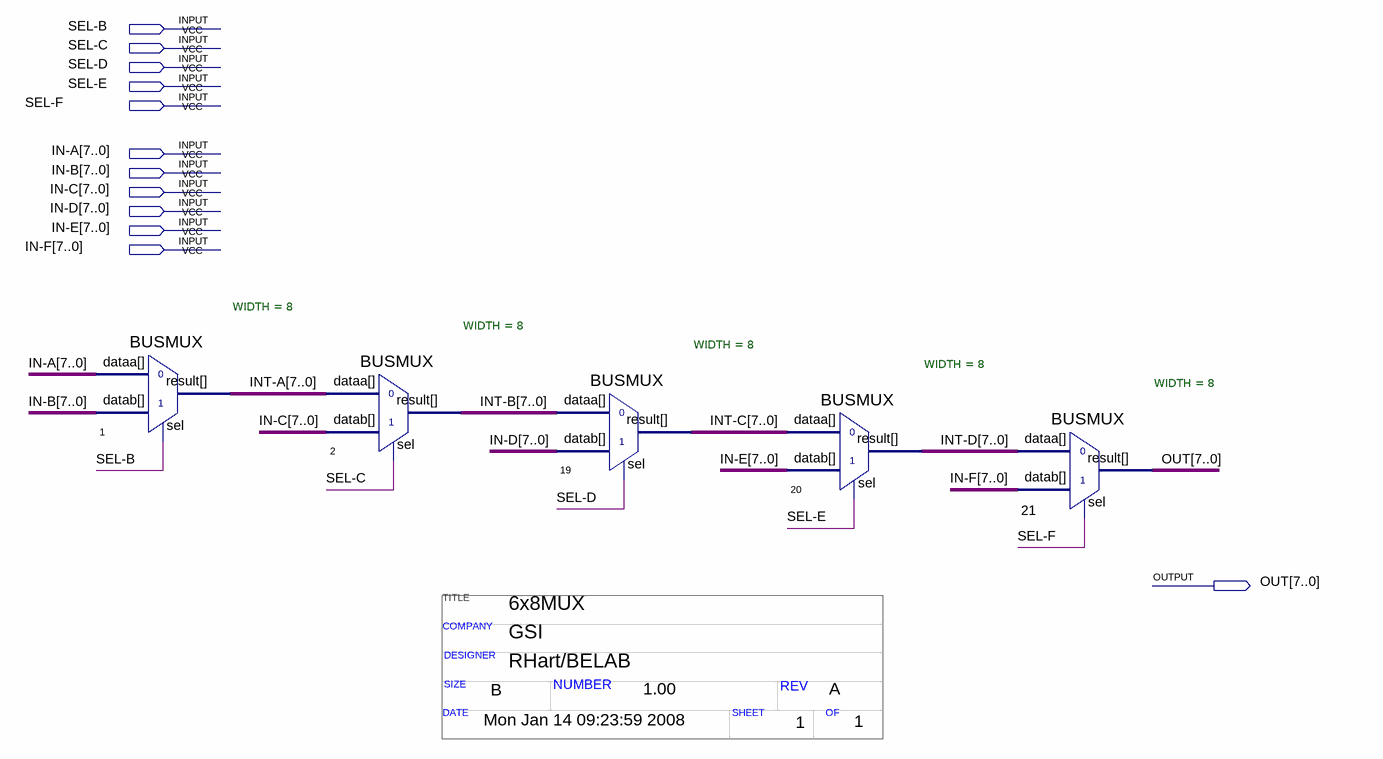
[diagram p0: schematic sheet]
// Quartus schematic 6x8mux.bdf as structural Verilog: 5 symbols, 12 pins
// Title block: TITLE: 6x8MUX; COMPANY: GSI; DESIGNER: RHart/BELAB; SIZE: B; NUMBER: 1.00; REV: A; DATE: Mon Jan 14 09:23:59 2008; SHEET: 1; OF: 1
module \6x8mux  (
  input  \SEL-B ,
  input  \SEL-C ,
  input  \SEL-D ,
  input  \SEL-E ,
  input  \SEL-F ,
  input  [7:0] \IN-A ,
  input  [7:0] \IN-B ,
  input  [7:0] \IN-C ,
  input  [7:0] \IN-D ,
  input  [7:0] \IN-E ,
  input  [7:0] \IN-F ,
  output [7:0] OUT
);

  wire [7:0] \INT-A , \INT-B , \INT-C , \INT-D ;

  BUSMUX #(.WIDTH(8)) u_1 (.datab(\IN-B ), .sel(\SEL-B ), .dataa(\IN-A ), .result(\INT-A ));
  BUSMUX #(.WIDTH(8)) u_2 (.datab(\IN-C ), .sel(\SEL-C ), .dataa(\INT-A ), .result(\INT-B ));
  BUSMUX #(.WIDTH(8)) u_19 (.datab(\IN-D ), .sel(\SEL-D ), .dataa(\INT-B ), .result(\INT-C ));
  BUSMUX #(.WIDTH(8)) u_20 (.datab(\IN-E ), .sel(\SEL-E ), .dataa(\INT-C ), .result(\INT-D ));
  BUSMUX #(.WIDTH(8)) u_21 (.datab(\IN-F ), .sel(\SEL-F ), .dataa(\INT-D ), .result(OUT));
endmodule
